# EAGLE design VCO (EAGLE 9.2.2)
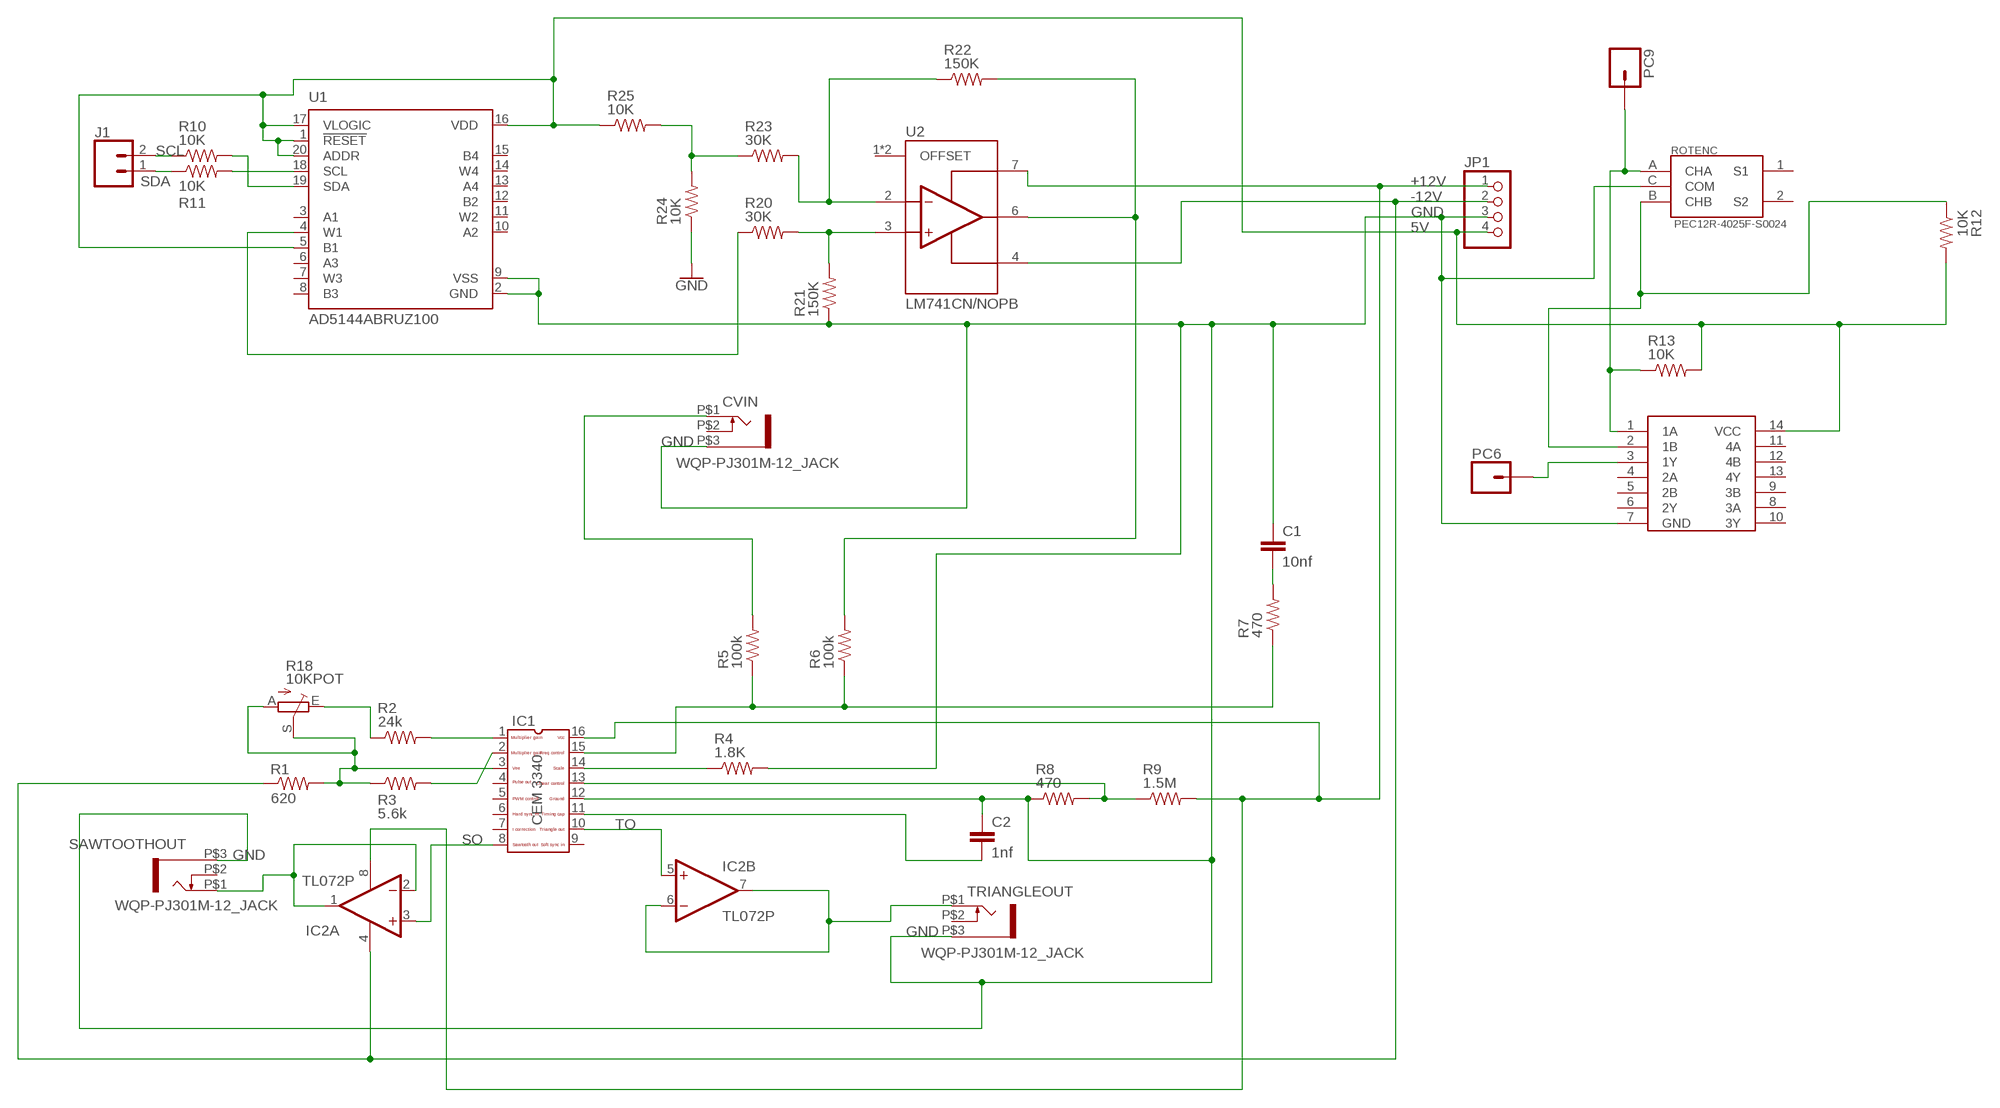
[diagram p0: schematic, sheet 1]

## Parts
C1  10nf  C2,5-3  [C2.5-3]
C2  1nf  C2,5-3  [C2.5-3]
CVIN  WQP-PJ301M-12_JACK  [WQP-PJ301M-12_JACK]
IC1  CEM3340  [DIL16]
IC2  TL072P  [DIL08]
J1  CONN_02  [1X02]
JP1  PINHD-1X4  [1X04]
PC6  CONN_01  [1X01]
PC9  CONN_01  [1X01]
R1  620  R-US_0207/10  [0207/10]
R2  24k  R-US_0207/10  [0207/10]
R3  5.6k  R-US_0207/10  [0207/10]
R4  1.8K  R-US_0207/10  [0207/10]
R5  100k  R-US_0207/10  [0207/10]
R6  100k  R-US_0207/10  [0207/10]
R7  470  R-US_0207/10  [0207/10]
R8  470  R-US_0207/10  [0207/10]
R9  1.5M  R-US_0207/10  [0207/10]
R10  10K  R-US_0207/10  [0207/10]
R11  10K  R-US_0207/10  [0207/10]
R12  10K  R-US_0207/10  [0207/10]
R13  10K  R-US_0207/10  [0207/10]
R18  10KPOT  TRIM_EU-B25P  [B25P]
R20  30K  R-US_0207/10  [0207/10]
R21  150K  R-US_0207/10  [0207/10]
R22  150K  R-US_0207/10  [0207/10]
R23  30K  R-US_0207/10  [0207/10]
R24  10K  R-US_0207/10  [0207/10]
R25  10K  R-US_0207/10  [0207/10]
ROTENC  PEC12R-4025F-S0024  [ENC_PEC12R-4025F-S0024]
SAWTOOTHOUT  WQP-PJ301M-12_JACK  [WQP-PJ301M-12_JACK]
TRIANGLEOUT  WQP-PJ301M-12_JACK  [WQP-PJ301M-12_JACK]
U1  AD5144ABRUZ100  [SOP65P640X120-20N]
U2  LM741CN/NOPB  [DIP794W45P254L1016H508Q8]
XOR  SN54HC86  [DIP762W51P254L1994H508Q14]

## Nets
5V: JP1.4 R12.2 R13.2 R25.1 U1.1(!RESET) U1.5(B1) U1.16(VDD) U1.17(VLOGIC) U1.20(ADDR) XOR.14(VCC)
+12V: IC1.16 IC2.8(P:V+) JP1.1 R9.2 U2.7(V+)
-12V: IC2.4(P:V-) JP1.2 R1.1 U2.4(V-)
GND: C1.1 C2.1 CVIN.P$3 IC1.12 JP1.3 R4.2 R8.1 R21.1 R24.1 ROTENC.C(COM) SAWTOOTHOUT.P$3 TRIANGLEOUT.P$3 U1.2(GND) U1.9(VSS) XOR.7(GND)
N$1: IC1.1 R2.2
N$2: IC1.2 R3.2
N$3: IC1.3 R1.2 R3.1 R18.A R18.S
N$4: PC9.1 R13.1 ROTENC.A(CHA) XOR.1(1A)
N$5: R12.1 ROTENC.B(CHB) XOR.2(1B)
N$6: IC1.14 R4.1
N$7: IC1.15 R5.1 R6.1 R7.1
N$8: R6.2 R22.2 U2.6(OUTPUT)
N$9: CVIN.P$1 R5.2
N$10: C1.2 R7.2
N$11: IC2.6(B:-IN) IC2.7(B:OUT) TRIANGLEOUT.P$1
N$12: IC1.13 R8.2 R9.1
N$13: C2.2 IC1.11
N$14: IC2.1(A:OUT) IC2.2(A:-IN) SAWTOOTHOUT.P$1
N$15: R2.1 R18.E
N$17: R11.2 U1.18(SCL)
N$18: R20.2 R21.2 U2.3(NON-INV_INPUT)
N$20: R22.1 R23.2 U2.2(INV_INPUT)
N$21: R23.1 R24.2 R25.2
N$22: R20.1 U1.4(W1)
N$23: R10.2 U1.19(SDA)
N$25: PC6.1 XOR.3(1Y)
SCL: J1.2 R10.1
SDA: J1.1 R11.1
SO: IC1.8 IC2.3(A:+IN)
TO: IC1.10 IC2.5(B:+IN)
Unconnected: CVIN.P$2 IC1.4 IC1.5 IC1.6 IC1.7 IC1.9 ROTENC.1(S1) ROTENC.2(S2) SAWTOOTHOUT.P$2 TRIANGLEOUT.P$2 U1.3(A1) U1.6(A3) U1.7(W3) U1.8(B3) U1.10(A2) U1.11(W2) U1.12(B2) U1.13(A4) U1.14(W4) U1.15(B4) U2.1(OFFSET) U2.5(OFFSET) XOR.4(2A) XOR.5(2B) XOR.6(2Y) XOR.8(3A) XOR.9(3B) XOR.10(3Y) XOR.11(4A) XOR.12(4B) XOR.13(4Y)

## Library data of the parts
C1 C2 = capacitor-wima:C: CAPACITOR naming: grid - package width
CVIN SAWTOOTHOUT TRIANGLEOUT = thonkiconn:WQP-PJ301M-12_JACK
IC1 = CEM:CEM3340: CEM 3340 VCO
IC2 = linear:TL072: OP AMP
J1 = SparkFun-Connectors:CONN_02: Multi connection point. Often used as Generic Header-pin footprint for 0.1 inch spaced/style header connections On any of the 0.1 inch spaced packages, you can populate with these: Break Away Headers - Straight <https://www.sparkfun.com/products/116> (PRT-00116) Break Away Male Headers - Right Angle <https://www.sparkfun.com/products/553> (PRT-00553) Female Headers <https://www.sparkfun.com/products/115> (PRT-00115) Break Away Headers - Machine Pin <https://www.sparkfun.com/products/117> (PRT-00117) Break Away Female Headers - Swiss Machine Pin <https://www.sparkfun.com/products/743> (PRT-00743) For SCREWTERMINALS and SPRING TERMINALS visit here: Screw Terimnals on SparkFun.com <https://www.sparkfun.com/search/results?term=Screw+Terminals> (5mm/3.5mm/2.54mm spacing) This device is also useful as a general connection point to wire up your design to another part of your project. Our various solder wires solder well into these plated through hole pads. Hook-Up Wire - Assortment (Stranded, 22 AWG) <https://www.sparkfun.com/products/11375> (PRT-11375) Hook-Up Wire - Assortment (Solid Core, 22 AWG) <https://www.sparkfun.com/products/11367> (PRT-11367) View the entire wire category on our website here <https://www.sparkfun.com/categories/141> Special notes: Molex polarized connector foot print use with: PRT-08233 with associated crimp pins and housings. 2.54_SCREWTERM for use with PRT-10571. 3.5mm Screw Terminal footprints for PRT-08084 5mm Screw Terminal footprints for use with PRT-08432
JP1 = pinhead:PINHD-1X4: PIN HEADER
PC6 PC9 = SparkFun-Connectors:CONN_01: Single connection point. Often used as Generic Header-pin footprint for 0.1 inch spaced/style header connections On any of the 0.1 inch spaced packages, you can populate with these: Break Away Headers - Straight <https://www.sparkfun.com/products/116> (PRT-00116) Break Away Male Headers - Right Angle <https://www.sparkfun.com/products/553> (PRT-00553) Female Headers <https://www.sparkfun.com/products/115> (PRT-00115) Break Away Headers - Machine Pin <https://www.sparkfun.com/products/117> (PRT-00117) Break Away Female Headers - Swiss Machine Pin <https://www.sparkfun.com/products/743> (PRT-00743) This device is also useful as a general connection point to wire up your design to another part of your project. Our various solder wires solder well into these plated through hole pads. Hook-Up Wire - Assortment (Stranded, 22 AWG) <https://www.sparkfun.com/products/11375> (PRT-11375) Hook-Up Wire - Assortment (Solid Core, 22 AWG) <https://www.sparkfun.com/products/11367> (PRT-11367) View the entire wire category on our website here <https://www.sparkfun.com/categories/141> Special notes: SMTSO-256-ET is a "flush mount" nut for a 4-40 screw. We mostly use this on specialty testbeds; it is a nice way to connect hardware to your PCB at an adjustable hieght. Also note, the SNAP packages are for using a snappable style connector. We sell a baggie of snaps and they are also used on two LilyPad designs: Snap Assortment - 30 pack (male and female) <https://www.sparkfun.com/products/11347> (DEV-11347) LilyPad Arduino SimpleSnap <https://www.sparkfun.com/products/10941> (DEV-10941) LilyPad SimpleSnap Protoboard <https://www.sparkfun.com/products/10940> (DEV-10940)
R1-R13 R20-R25 = rcl:R-US_: RESISTOR, American symbol; SPICEPREFIX: R
R18 = pot:TRIM_EU-: POTENTIOMETER
ROTENC = PEC12R-4025F-S0024:PEC12R-4025F-S0024: Encoder 12mm 0detents 20mm Shft Push Momentry Sw 24 Pulse; AVAILABILITY: Unavailable; DESCRIPTION: Encoder 12mm 0detents 20mm Shft Push Momentry Sw 24 Pulse; MF: Bourns; MP: PEC12R-4025F-S0024; PACKAGE: None; PRICE: None
U1 = AD5144ABRUZ100:AD5144ABRUZ100: Digital Potentiometer 256POS 10KOhm Quad 20-Pin TSSOP Tube; AVAILABILITY: Unavailable; DESCRIPTION: Digital Potentiometer 256POS 100KOhm Quad 20-Pin TSSOP Tube; MF: Analog Devices; MP: AD5144ABRUZ100; PACKAGE: TSSOP-20 Analog Devices; PRICE: None
U2 = LM741CN_NOPB:LM741CN/NOPB; AVAILABILITY: Unavailable; DESCRIPTION: IC OPAMP GP 1 CIRCUIT 8DIP; MF: Texas Instruments; MP: LM741CN; PACKAGE: DIP-8 Rochester Electronics; PRICE: None
XOR = DIP762W51P254L1994H508Q14:SN54HC86

## Board
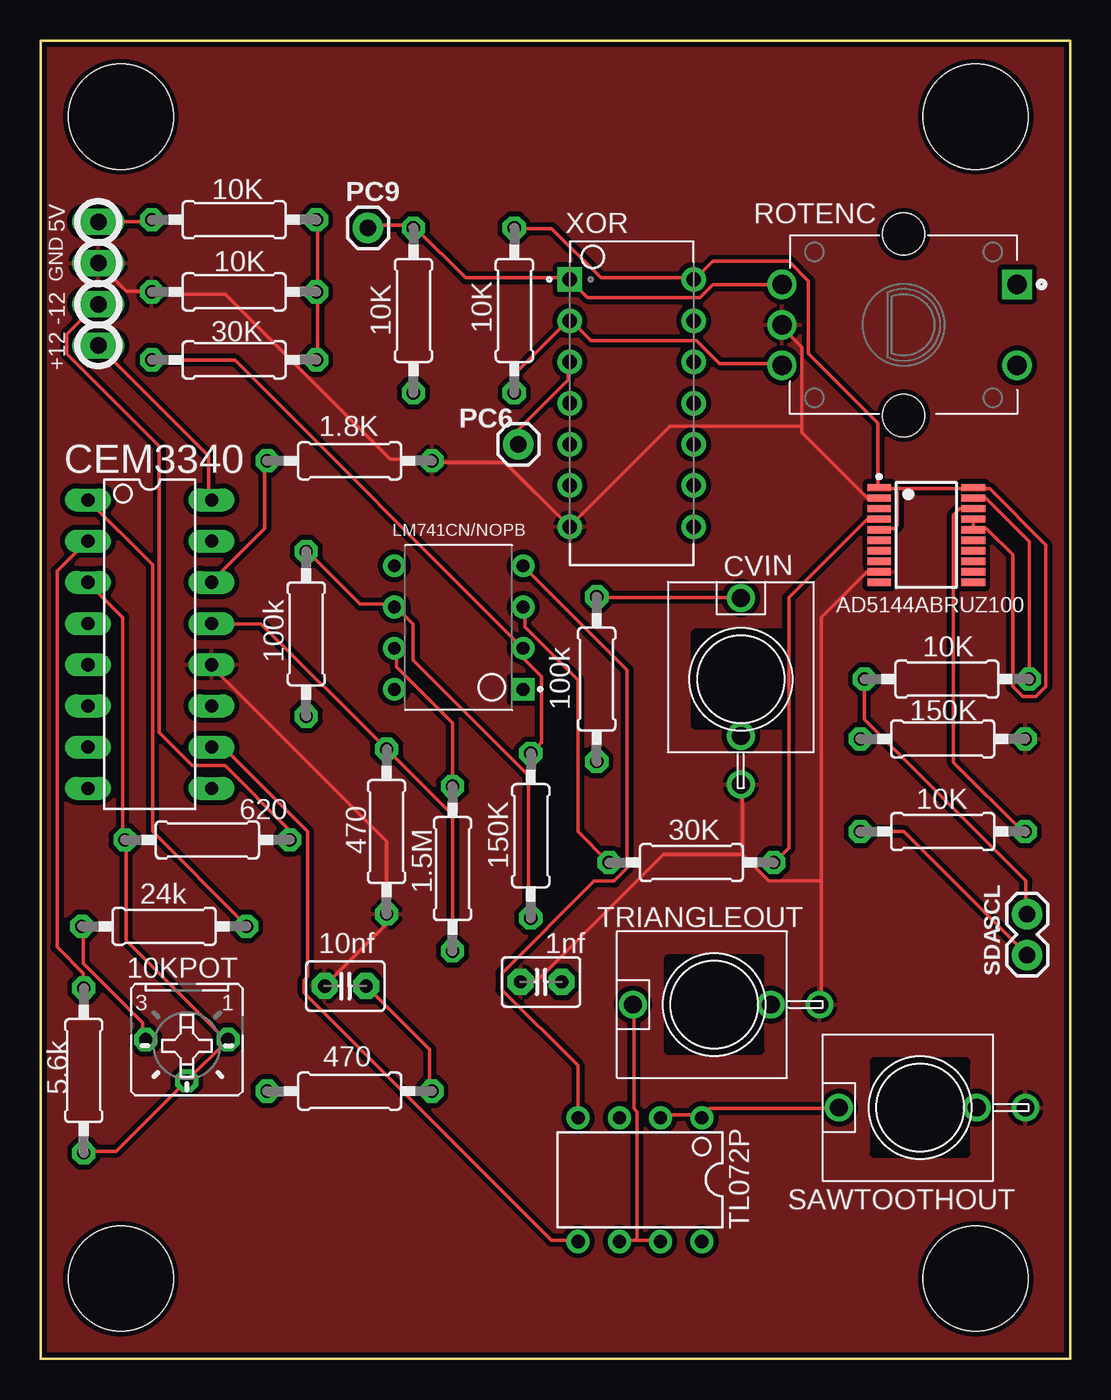
[diagram p1: board, top side]
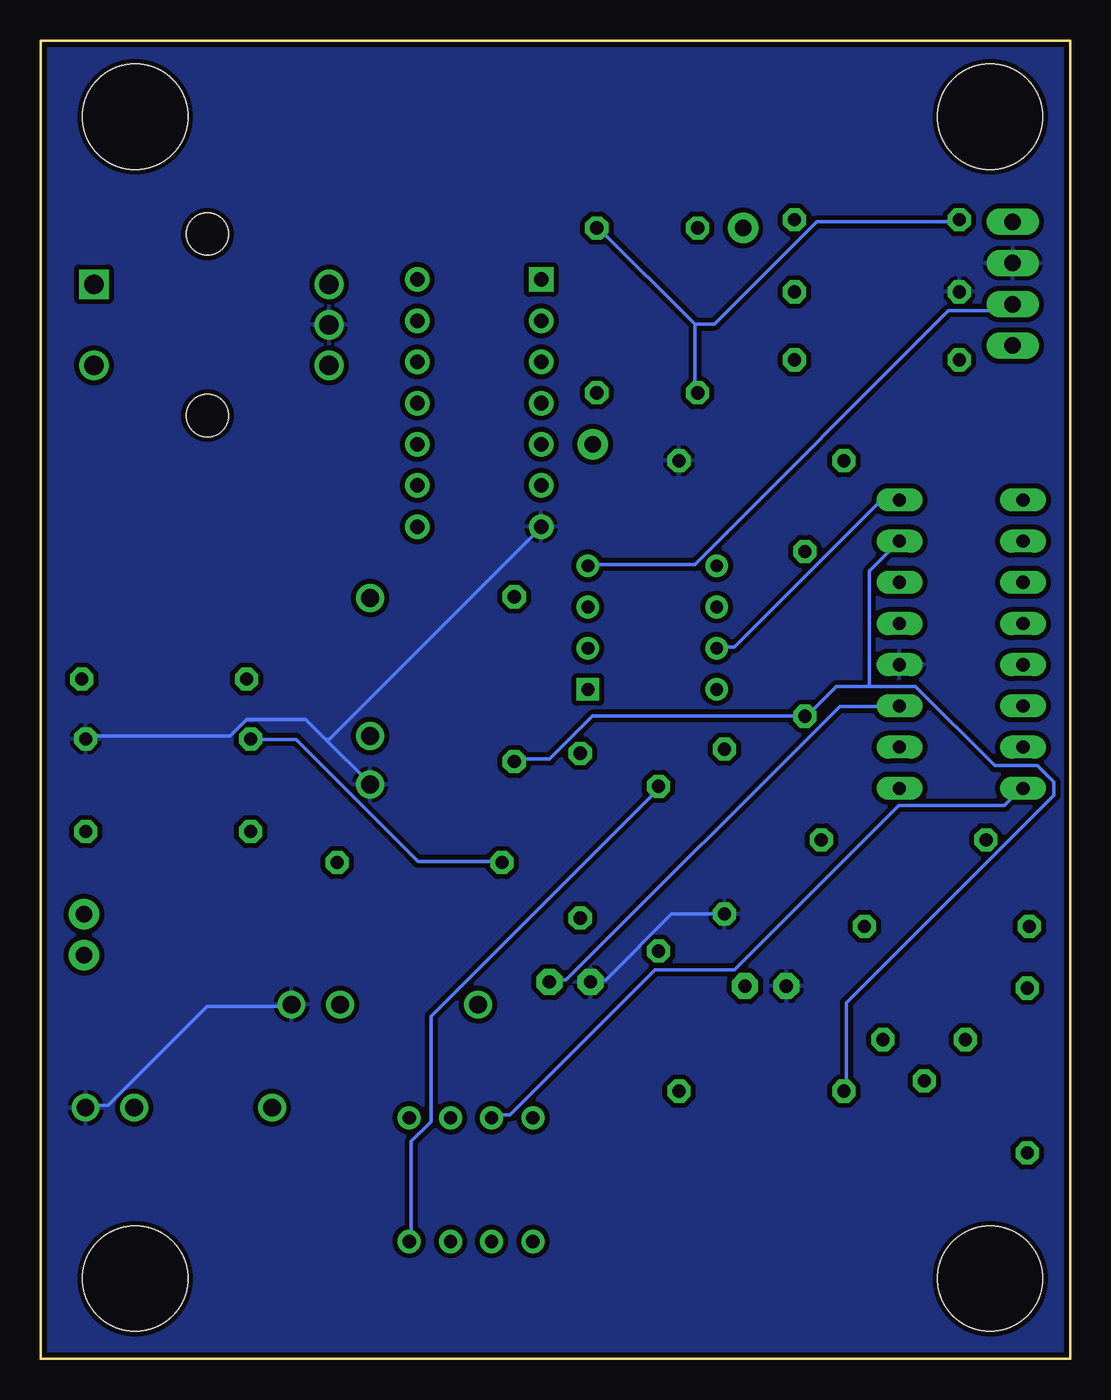
[diagram p2: board, bottom side, seen from below]

Size 63.5 x 81.28 mm. Coordinates in mm from the lower left corner, seen from the top.
Outline: 0,0 0,81.28 63.5,81.28 63.5,0 0,0
Copper layers (1*16): Top 0.035mm / dielectric 1.5mm / Bottom 0.035mm
Design rules "SparkFun": minimum track width 8mil, minimum drill 20mil, track to track 8mil, track to pad 8mil, pad to pad 8mil, via to via 8mil, smd to smd 8mil, copper to edge 8mil, drill to drill 8mil, minimum pad ring 12mil, minimum via ring 10mil, stop-mask expansion 4mil, vias tented up to drill 20mil, thermal gap 10mil
Holes 6.48 mm at 4.95,4.95 57.66,4.95 4.95,76.58 57.66,76.58

### Footprints (pad centres in the part's own frame; a part is rotated, then mirrored left to right if it is on the bottom)
C2.5-3 = drill 0.813 pad 1.6 octagon: 1 -1.27,0; 2 1.27,0
WQP-PJ301M-12_JACK = drill 1.1: P$1 0,5; P$2 0,-3.5; P$3 0,-6.5
DIL16 = drill 0.813 long: 1 -8.89,-3.81; 2 -6.35,-3.81; 3 -3.81,-3.81; 4 -1.27,-3.81; 5 1.27,-3.81; 6 3.81,-3.81; 7 6.35,-3.81; 8 8.89,-3.81; 9 8.89,3.81; 10 6.35,3.81; 11 3.81,3.81; 12 1.27,3.81; 13 -1.27,3.81; 14 -3.81,3.81; 15 -6.35,3.81; 16 -8.89,3.81
DIL08 = drill 0.813 pad 1.27: 1 -3.81,-3.81; 2 -1.27,-3.81; 3 1.27,-3.81; 4 3.81,-3.81; 5 3.81,3.81; 6 1.27,3.81; 7 -1.27,3.81; 8 -3.81,3.81
1X02 = drill 1.016 pad 1.88: 1 0,0; 2 2.54,0
1X04 = drill 1.016 long: 1 -3.81,0; 2 -1.27,0; 3 1.27,0; 4 3.81,0
1X01 = drill 1.016 pad 1.88: 1 0,0
0207/10 = drill 0.813 octagon: 1 -5.08,0; 2 5.08,0
B25P = drill 0.813 octagon: A -2.54,0; E 2.54,0; S 0,2.54
ENC_PEC12R-4025F-S0024 = drill 1.2 pad 1.8 square: 1 7,2.5 | drill 1.2 pad 1.8: 2 7,-2.5; A -7.5,2.5; B -7.5,-2.5; C -7.5,0 | hole 2.6: 0,5.6; 0,-5.6
SOP65P640X120-20N = smd 1.45 x 0.45: 1 -2.9,2.925; 2 -2.9,2.275; 3 -2.9,1.625; 4 -2.9,0.975; 5 -2.9,0.325; 6 -2.9,-0.325; 7 -2.9,-0.975; 8 -2.9,-1.625; 9 -2.9,-2.275; 10 -2.9,-2.925; 11 2.9,-2.925; 12 2.9,-2.275; 13 2.9,-1.625; 14 2.9,-0.975; 15 2.9,-0.325; 16 2.9,0.325; 17 2.9,0.975; 18 2.9,1.625; 19 2.9,2.275; 20 2.9,2.925
DIP794W45P254L1016H508Q8 = drill 0.78 pad 1.13 square: 1 -3.97,3.81 | drill 0.78 pad 1.13: 2 -3.97,1.27; 3 -3.97,-1.27; 4 -3.97,-3.81; 5 3.97,-3.81; 6 3.97,-1.27; 7 3.97,1.27; 8 3.97,3.81
DIP762W51P254L1994H508Q14 = drill 0.9 pad 1.35 square: 1 -3.81,7.62 | drill 0.9 pad 1.35: 2 -3.81,5.08; 3 -3.81,2.54; 4 -3.81,0; 5 -3.81,-2.54; 6 -3.81,-5.08; 7 -3.81,-7.62; 8 3.81,-7.62; 9 3.81,-5.08; 10 3.81,-2.54; 11 3.81,0; 12 3.81,2.54; 13 3.81,5.08; 14 3.81,7.62

### Placement (x,y rotation side)
C1  18.8,22.99 0 top
C2  30.86,23.24 0 top
CVIN  43.18,41.91 0 top
IC1  6.73,44.07 270 top
IC2  36.96,11.05 180 top
J1  60.83,24.89 90 top
JP1  3.56,66.29 90 top
PC6  29.46,56.39 0 top
PC9  20.19,69.72 0 top
R1  10.29,32 180 top
R2  7.62,26.67 0 top
R3  2.67,17.78 90 top
R4  19.05,55.37 0 top
R5  34.29,41.91 90 top
R6  16.38,44.7 90 top
R7  19.05,16.51 0 top
R8  21.34,32.51 90 top
R9  25.4,30.23 90 top
R10  55.88,41.91 0 top
R11  55.63,32.51 0 top
R12  29.21,64.64 90 top
R13  22.99,64.64 270 top
R18  9.02,19.68 180 top
R20  40.13,30.61 180 top
R21  55.63,38.23 180 top
R22  30.23,32.26 270 top
R23  11.94,61.59 180 top
R24  11.94,65.79 0 top
R25  11.94,70.23 0 top
ROTENC  53.21,63.75 0 top
SAWTOOTHOUT  54.23,15.49 90 top
TRIANGLEOUT  41.53,21.84 90 top
U1  54.61,50.8 0 top
U2  25.78,45.09 180 top
XOR  36.45,58.93 0 top

### Tracks (layer width: path | path; a pad name or v marks a point on that pad's centre or on a via)
5V
  Top 0.203: U1.17 57.51,51.61 57.51,51.21 U1.16 57.71,51.21 58.32,51.21 59.94,49.58 59.94,41.45 60.55,40.84 61.37,40.84 61.98,41.45 61.98,50.19 58.52,53.65 57.71,53.65 U1.20 57.51,53.65 52.63,53.65 | 52.63,53.65 52.83,53.44 52.83,51.41 52.63,51.21 51.82,51.21 U1.5 | 52.63,53.65 51.82,53.65 U1.1 51.61,53.85 51.61,57.71 47.35,61.98 47.35,66.45 46.13,67.67 41.45,67.67 40.44,66.65 XOR.14 40.23,66.65 34.54,66.65 31.5,69.7 29.26,69.7 R12.2 | JP1.4 6.71,70.1 R25.1
  Bottom 0.203: 23.16,63.8 23.16,59.74 R13.2 | 23.16,63.8 29.06,69.7 R12.2 | 23.16,63.8 21.95,63.8 15.65,70.1 6.91,70.1 R25.1
+12V
  Top 0.203: JP1.1 10.36,55.68 10.36,53.03 IC1.16 | R9.2 25.4,39.22 21.95,42.67 21.95,43.69 U2.7
  Bottom 0.203: IC2.8 40.64,7.32 40.64,13.41 39.42,14.63 39.42,21.13 25.4,35.15 R9.2 | IC1.16 10.57,52.83 11.79,52.83 20.73,43.89 21.74,43.89 U2.7
-12V
  Top 0.203: R1.1 15.24,32.11 15.24,32.72 11.38,36.58 9.35,36.58 7.32,38.61 7.32,56.29 1.63,61.98 1.63,63.2 3.45,65.02 JP1.2 | IC2.4 33.12,15.04 33.12,18.09 28.45,22.76 28.45,23.77 34.14,29.46 35.36,29.46 36.17,30.28 36.17,42.47 29.87,48.77 U2.4
  Bottom 0.203: U2.4 29.67,48.97 23.16,48.97 7.52,64.62 4.06,64.62 3.66,65.02 JP1.2
GND
  Top 0.203: 46.94,57.51 46.94,62.38 45.72,63.6 ROTENC.C | 46.94,57.51 46.94,57.1 51,53.03 51.61,53.03 U1.2 | JP1.3 5.28,65.84 6.71,65.84 R24.1 6.91,65.63 11.38,65.63 21.54,55.47 23.98,55.47 R4.2 24.18,55.27 28.65,55.27 32.51,51.41 XOR.7 32.72,51.41 38.81,57.51 46.94,57.51 | C1.1 17.68,23.16 21.34,26.82 R8.1 21.34,31.9 10.57,42.67 IC1.12 | 48.16,29.46 48.16,21.95 TRIANGLEOUT.P$3 | 48.16,29.46 48.16,45.72 51,48.56 51.61,48.56 U1.9 | 43.28,31.09 43.28,35.36 CVIN.P$3 | 43.28,31.09 44.91,29.46 48.16,29.46 | 43.28,31.09 38.41,31.09 30.68,23.37 29.67,23.37 C2.1
  Bottom 0.203: R8.1 24.59,27.43 28.65,23.37 29.46,23.37 C2.1 | 45.92,38.2 43.28,35.56 CVIN.P$3 | 45.92,38.2 47.14,39.42 50.8,39.42 51.82,38.41 60.55,38.41 R21.1 | SAWTOOTHOUT.P$3 60.55,15.65 59.33,15.65 53.24,21.74 48.16,21.74 TRIANGLEOUT.P$3 | 45.92,38.2 45.72,38.2 32.72,51.21 XOR.7
  pour Top (isolate 0.305): 0,81.28 0,0 63.5,0 63.5,81.28
  pour Bottom (isolate 0.305): 0,81.28 0,0 63.5,0 63.5,81.28
N$1
  Top 0.203: IC1.1 6.91,48.97 6.91,32.51 12.6,26.82 R2.2
N$2
  Top 0.203: R3.2 2.64,22.96 2.64,23.77 1.02,25.4 1.02,48.56 2.85,50.39 IC1.2
N$3
  Top 0.203: R3.1 2.85,12.8 4.67,12.8 R18.S R18.A 11.38,19.71 5.28,25.81 5.28,31.9 R1.2 5.08,32.11 5.08,45.72 IC1.3
N$4
  Top 0.203: PC9.1 20.32,69.9 22.96,69.9 R13.1 23.16,69.7 26.21,66.65 32.51,66.65 XOR.1 32.72,66.45 33.73,65.43 40.64,65.43 41.45,66.24 45.52,66.24 ROTENC.A
N$5
  Top 0.203: R12.1 29.26,59.74 29.26,60.76 32.51,64.01 XOR.2 32.72,64.01 33.93,62.79 40.44,62.79 41.86,61.37 45.52,61.37 ROTENC.B
N$6
  Top 0.203: IC1.14 10.57,47.95 13.82,51.21 13.82,55.27 R4.1
N$7
  Bottom 0.203: 12.39,41.45 14.43,41.45 16.26,39.62 R6.1 29.46,39.62 32.11,36.98 34.14,36.98 R5.1 | 12.39,41.45 9.55,41.45 4.67,36.58 2.03,36.58 1.02,35.56 1.02,34.75 13.82,21.95 13.82,16.66 R7.1 | IC1.15 12.39,48.56 12.39,41.45
N$8
  Top 0.203: R6.2 16.46,49.78 19.71,46.53 21.74,46.53 U2.6 21.95,46.33 22.96,45.31 22.96,43.08 30.07,35.97 30.07,27.23 R22.2
N$9
  Top 0.203: R5.2 34.34,46.94 43.08,46.94 CVIN.P$1
N$10
  Top 0.203: R7.2 23.98,16.66 23.98,19.1 20.12,22.96 C1.2
N$11
  Top 0.203: 36.78,7.32 38.2,7.32 IC2.7 | 36.78,7.32 35.76,7.32 IC2.6 | 36.78,7.32 36.78,15.24 36.58,15.44 36.58,21.74 TRIANGLEOUT.P$1
N$12
  Top 0.203: IC1.13 10.57,45.31 13.61,45.31 R8.2 25.4,33.53 R9.1
N$13
  Bottom 0.203: IC1.11 10.57,40.23 14.22,40.23 31.09,23.37 32.11,23.37 C2.2
N$14
  Top 0.203: IC2.2 38.41,15.04 40.64,15.04 IC2.1 40.84,15.04 41.25,15.44 49.17,15.44 SAWTOOTHOUT.P$1
N$15
  Top 0.203: R2.1 2.64,26.62 2.64,24.38 6.3,20.73 6.3,19.71 R18.E
N$17
  Top 0.203: U1.18 56.69,52.43 56.29,52.02 56.29,36.78 60.55,32.51 R11.2
N$18
  Top 0.203: U2.3 29.87,46.33 29.87,45.11 33.12,41.86 33.12,32.51 34.95,30.68 R20.2
  Bottom 0.203: R21.2 50.39,38.2 47.75,38.2 40.23,30.68 35.15,30.68 R20.2
N$20
  Top 0.203: R22.1 30.89,38 30.89,42.06 29.87,43.08 29.87,43.69 U2.2 29.67,43.89 11.99,61.57 6.91,61.57 R23.2
N$21
  Top 0.203: R23.1 17.07,61.77 17.07,65.63 R24.2 17.07,65.84 17.07,70.1 R25.2
N$22
  Top 0.203: U1.4 51.61,51.82 51,51.82 46.13,46.94 46.13,31.5 45.31,30.68 R20.1
N$23
  Top 0.203: R10.2 60.96,50.39 58.32,53.03 57.71,53.03 U1.19
N$25
  Top 0.203: PC6.1 29.46,57.3 32.51,60.35 32.51,61.37 XOR.3
SCL
  Top 0.203: R10.1 50.8,39.42 60.76,29.46 60.76,27.43 J1.2
SDA
  Top 0.203: R11.1 53.24,32.51 60.76,24.99 J1.1
SO
  Bottom 0.203: IC2.3 35.56,15.04 34.54,15.04 25.6,23.98 20.73,23.98 10.57,34.14 4.06,34.14 3.05,35.15 IC1.8
TO
  Top 0.203: IC1.10 10.57,37.59 11.38,37.59 16.46,32.51 16.46,23.57 16.26,23.37 16.26,22.55 31.5,7.32 33.12,7.32 IC2.5

### Text on the board
tPlace: 5V | GND | -12 | +12 | SCL | SDA